# EAGLE design Patch_Anetnna_16_8 (EAGLE 7.4.0)
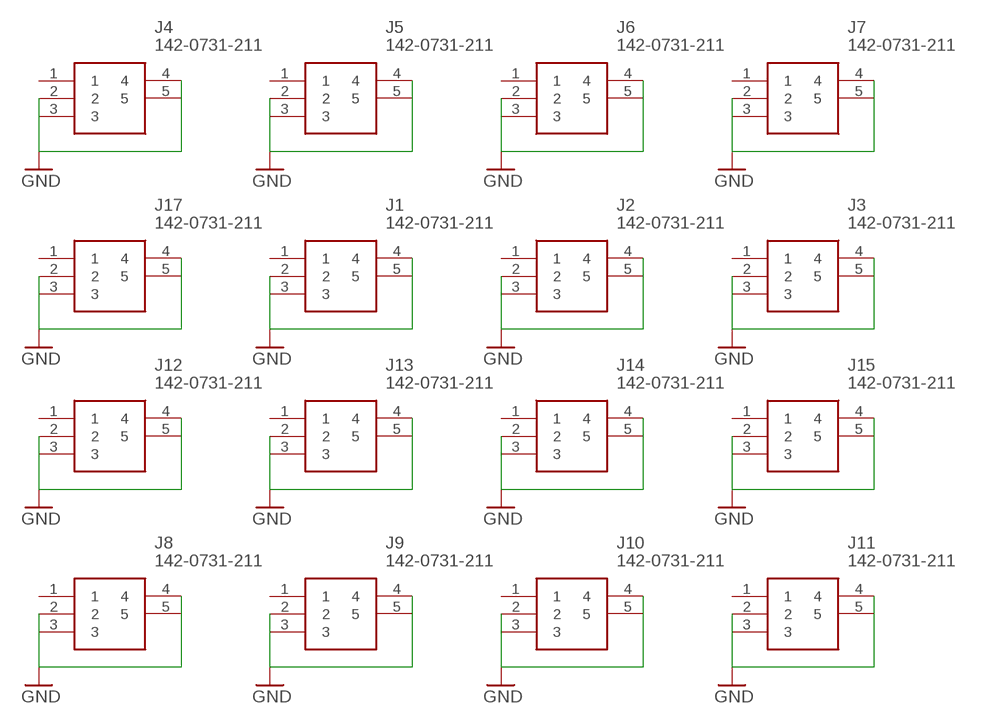
[diagram p0: schematic, sheet 1]

## Parts
J1  142-0731-211  [1420731211]
J2  142-0731-211  [1420731211]
J3  142-0731-211  [1420731211]
J4  142-0731-211  [1420731211]
J5  142-0731-211  [1420731211]
J6  142-0731-211  [1420731211]
J7  142-0731-211  [1420731211]
J8  142-0731-211  [1420731211]
J9  142-0731-211  [1420731211]
J10  142-0731-211  [1420731211]
J11  142-0731-211  [1420731211]
J12  142-0731-211  [1420731211]
J13  142-0731-211  [1420731211]
J14  142-0731-211  [1420731211]
J15  142-0731-211  [1420731211]
J17  142-0731-211  [1420731211]

## Nets
GND: J1.2 J1.3 J1.4 J1.5 J2.2 J2.3 J2.4 J2.5 J3.2 J3.3 J3.4 J3.5 J4.2 J4.3 J4.4 J4.5 J5.2 J5.3 J5.4 J5.5 J6.2 J6.3 J6.4 J6.5 J7.2 J7.3 J7.4 J7.5 J8.2 J8.3 J8.4 J8.5 J9.2 J9.3 J9.4 J9.5 J10.2 J10.3 J10.4 J10.5 J11.2 J11.3 J11.4 J11.5 J12.2 J12.3 J12.4 J12.5 J13.2 J13.3 J13.4 J13.5 J14.2 J14.3 J14.4 J14.5 J15.2 J15.3 J15.4 J15.5 J17.2 J17.3 J17.4 J17.5
Unconnected: J1.1 J2.1 J3.1 J4.1 J5.1 J6.1 J7.1 J8.1 J9.1 J10.1 J11.1 J12.1 J13.1 J14.1 J15.1 J17.1

## Library data of the parts
J1-J15 J17 = 142-0731-211:142-0731-211: SMA Connector Jack, Female Socket 50 Ohms Through Hole Solder Source: Datasheet <https://www.cinch.com/media/drawings/products/rf-microwave/connectors/dr-CCS-JOHNS-142-0731-211.pdf>; DESCRIPTION: SMA Connector Jack, Female Socket 50 Ohms Through Hole Solder; HEIGHT: 9.8852mm; MANUFACTURER_NAME: Cinch Connectivity Solutions; MANUFACTURER_PART_NUMBER: 142-0731-211; MOUSER_PART_NUMBER: 530-142-0731-211; MOUSER_PRICE-STOCK: https://www.mouser.co.uk/ProductDetail/Johnson-Cinch-Connectivity-Solutions/142-0731-211?qs=HFfMDpzxxd0OVzI3hm9tuA%3D%3D

## Board
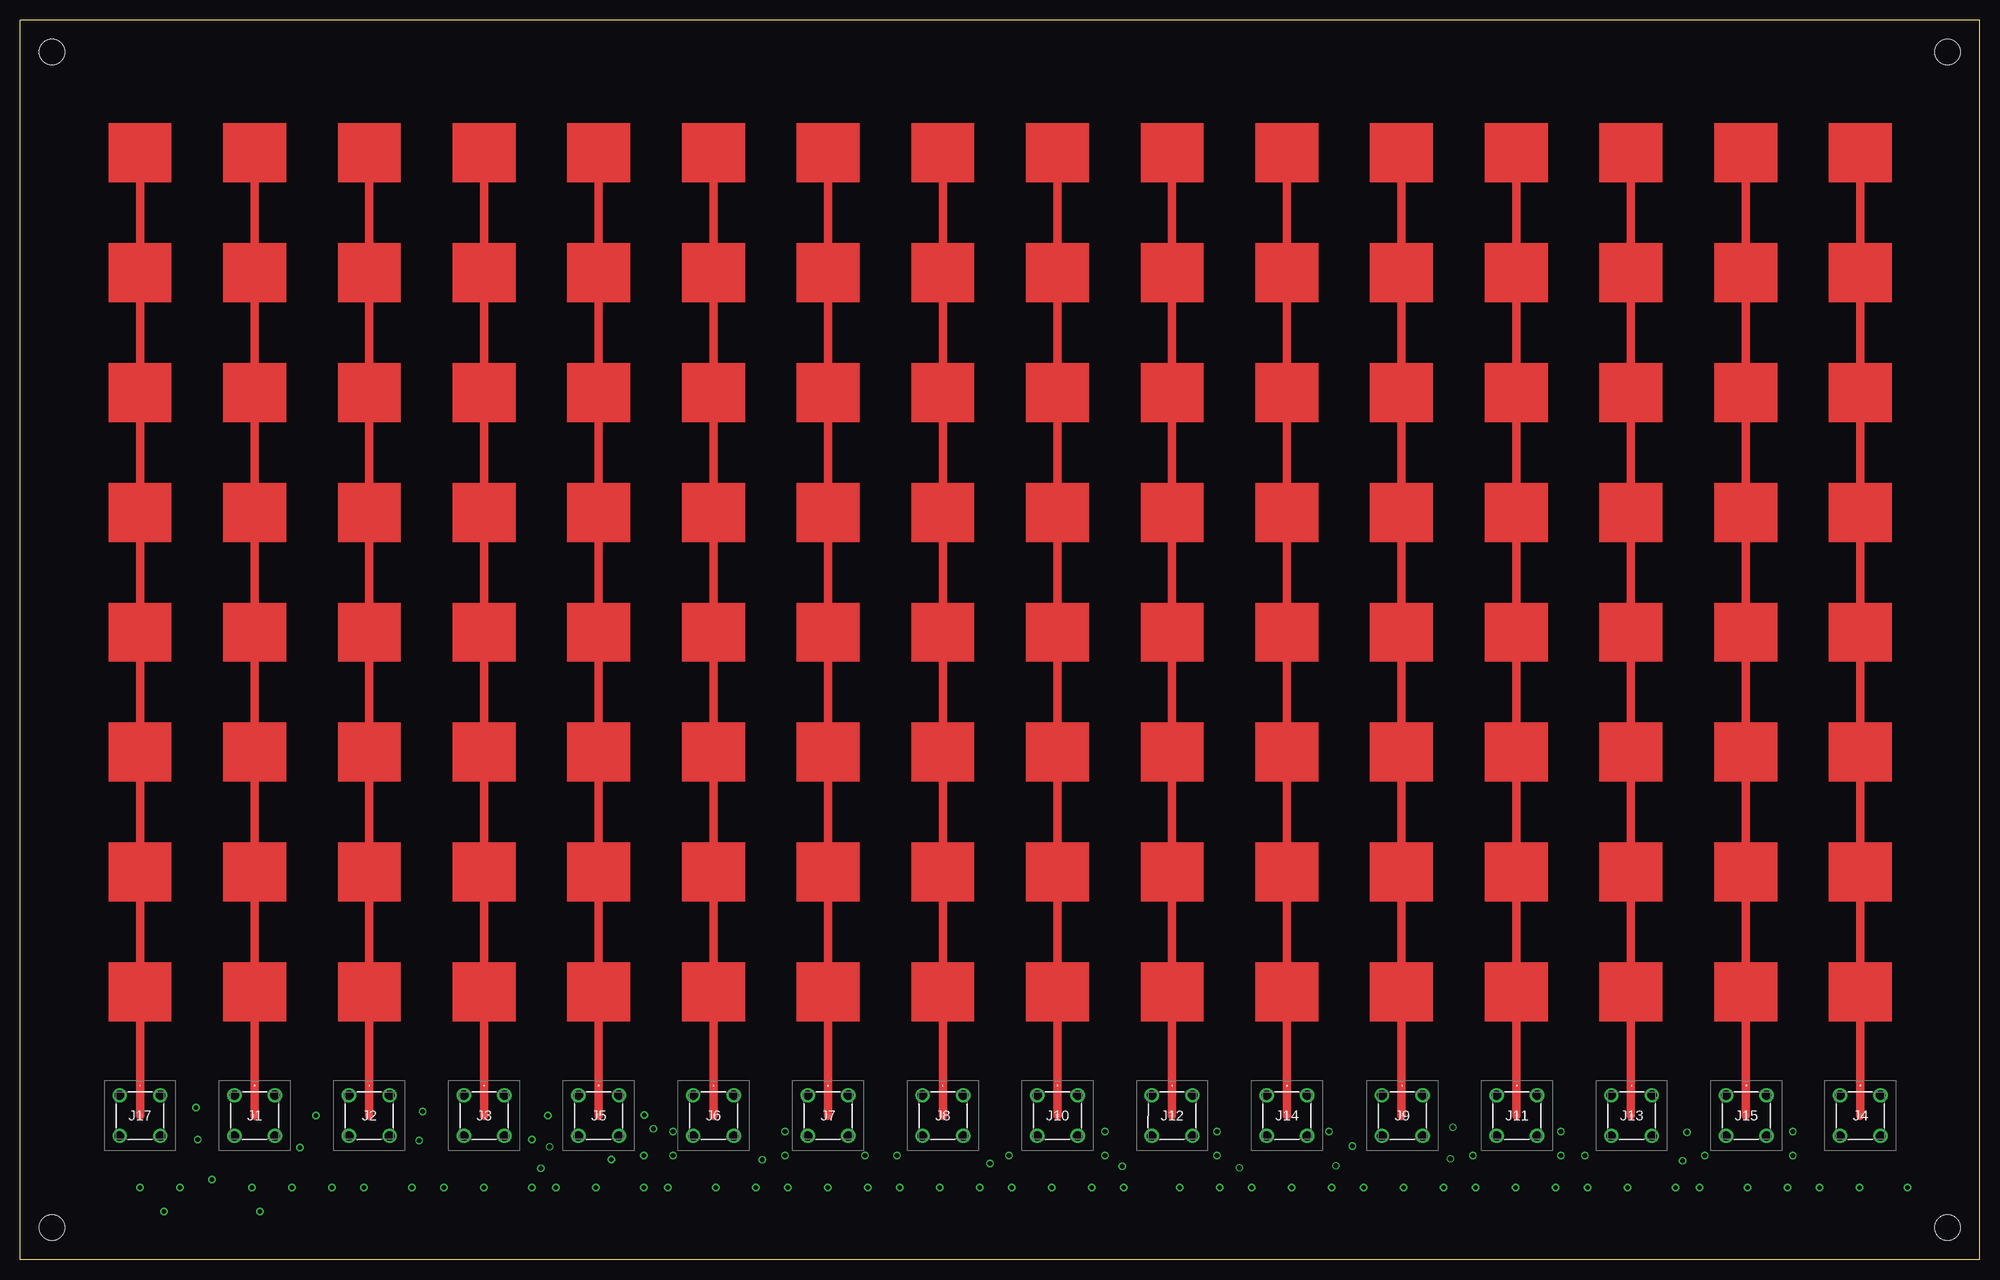
[diagram p1: board, top side]
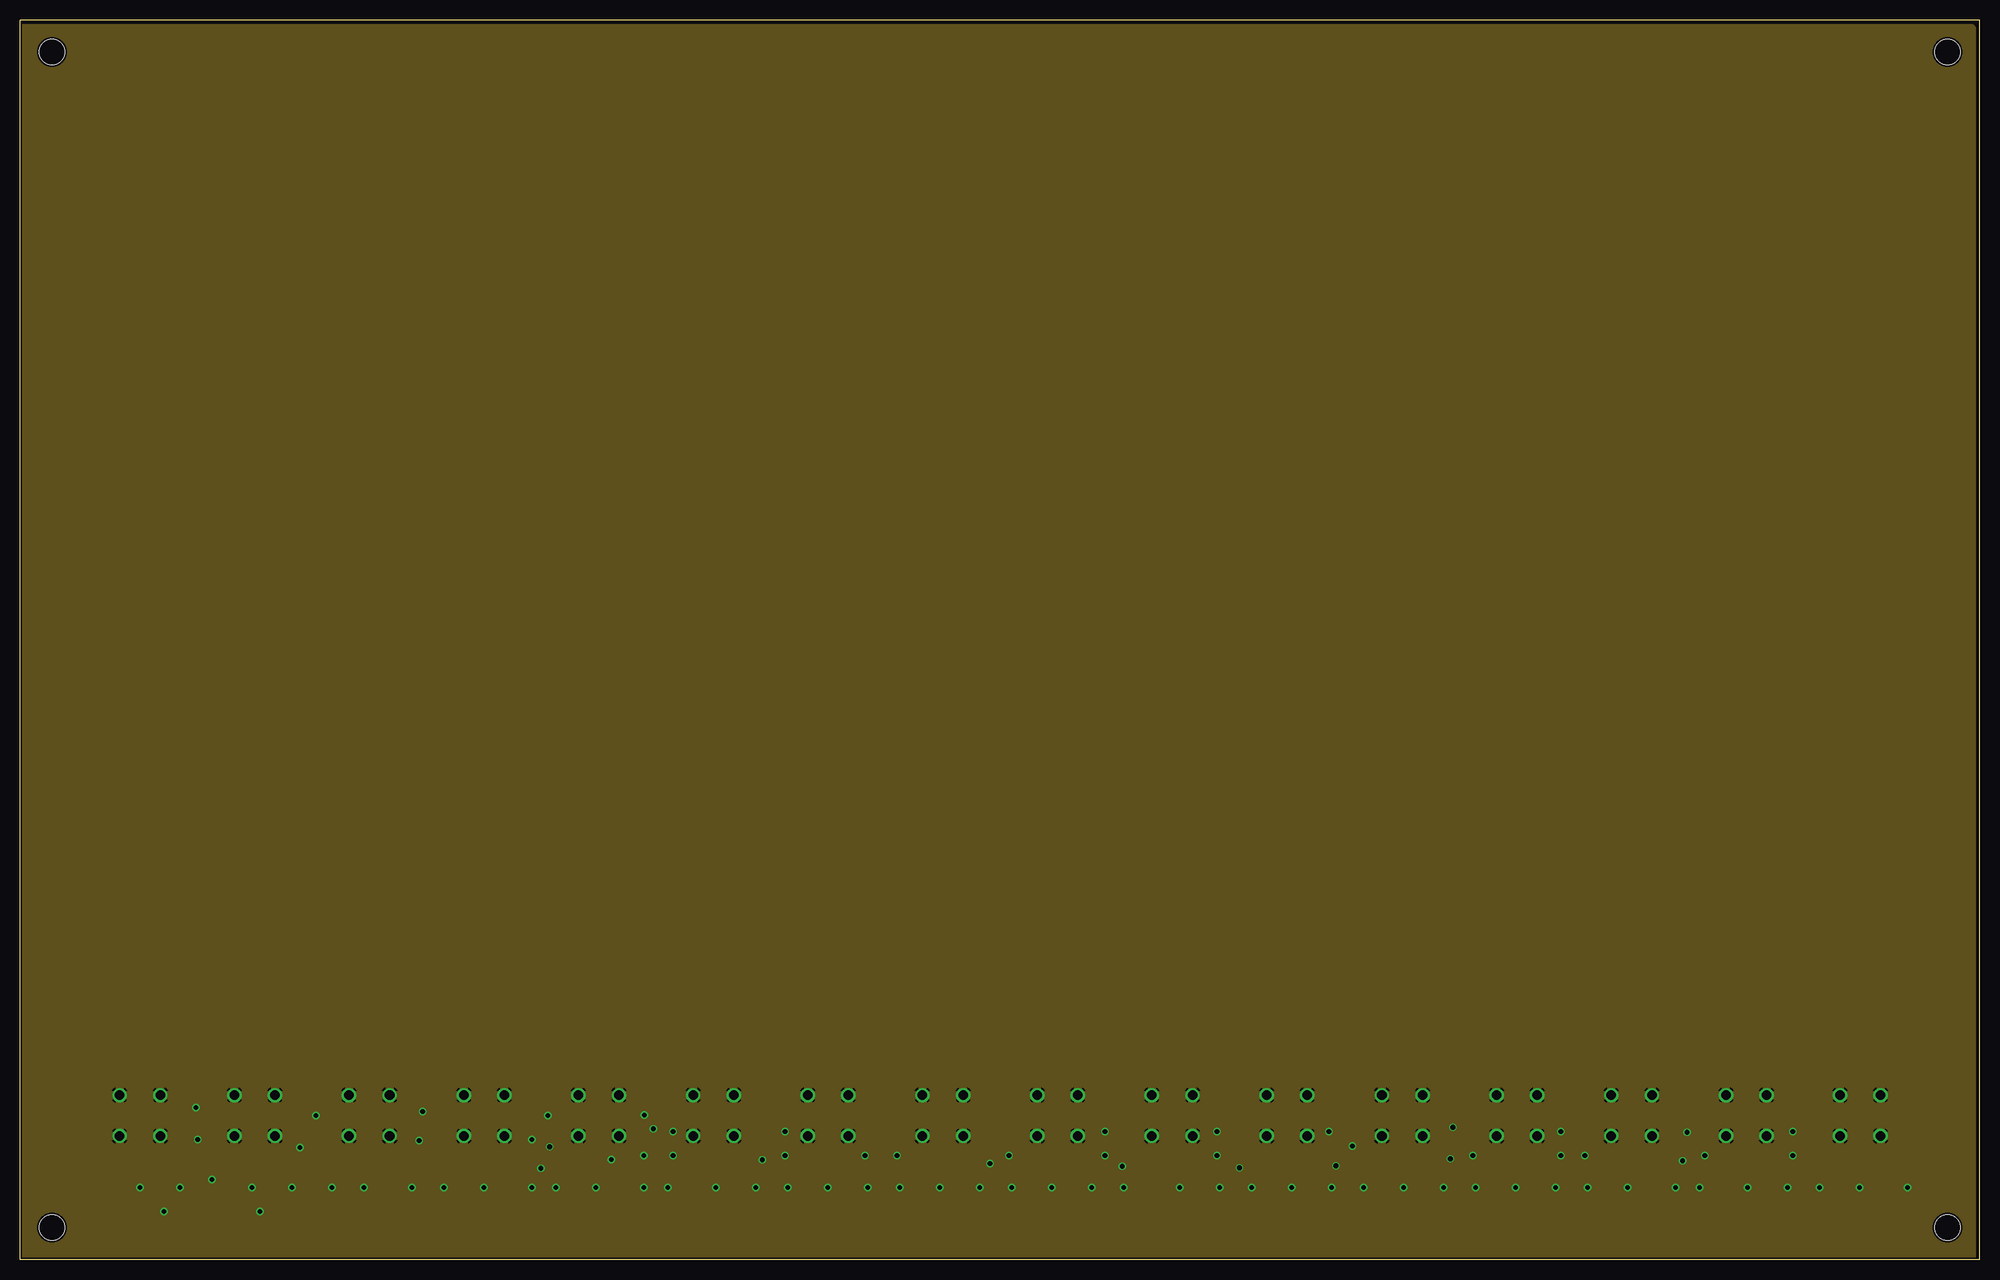
[diagram p2: board, inner layer Route2]

Size 245 x 155 mm. Coordinates in mm from the lower left corner, seen from the top.
Outline: 245,0 245,155 0,155 0,0 245,0
Copper layers (1+2*3+16): Top 0.035mm / dielectric 20mil / Route2 0.035mm / dielectric 0.102mm / Route3 0.035mm / dielectric 0.8mm / Bottom 0.035mm
Design rules "eC_4Layer_PClass4_BaseCopperO35-I70 *": minimum track width 0.2mm, minimum drill 0.35mm, track to track 0.25mm, track to pad 0.25mm, pad to pad 0.25mm, via to via 0.25mm, smd to smd 0mil, copper to edge 0.25mm, drill to drill 0.35mm, minimum pad ring 0.2mm, minimum via ring 0.15mm, stop-mask expansion 0mil, vias tented up to drill 0.45mm, thermal gap 0.2mm
Holes 3.2 mm at 4,4 241,4 241,151 4,151

### Footprints (pad centres in the part's own frame; a part is rotated, then mirrored left to right if it is on the bottom)
1420731211 = smd 0.559 x 0.559: 1 0,0 | drill 1.194 pad 1.791: 2 -2.54,2.54; 3 -2.54,-2.54; 4 2.54,-2.54; 5 2.54,2.54

### Placement (x,y rotation side)
J1  29.34,18 0 top
J2  43.68,18 0 top
J3  58.02,18 0 top
J4  230.1,18 0 top
J5  72.36,18 0 top
J6  86.7,18 0 top
J7  101.04,18 0 top
J8  115.38,18 0 top
J9  172.82,18 0 top
J10  129.72,18 0 top
J11  187.16,18 0 top
J12  144.06,18 0 top
J13  201.5,18 0 top
J14  158.4,18 0 top
J15  215.84,18 0 top
J17  15,18 0 top

### Tracks (layer width: path | path; a pad name or v marks a point on that pad's centre or on a via)
GND  (via drill 0.6)
  other vias: 15,9 20,9 18,6 22.21,15 24,10 22,19 29,9 34,9 30,6 35,14 39,9 43,9 43,9 49,9 37,18 49.89,14.88 50.33,18.5 53,9 53,9 58,9 64,9 66,18 64,15 66.21,14.09 67,9 72,9 78,9 78,13 79.18,16.35 65.13,11.4 81,9 78.07,18.07 81.66,16 73.94,12.5 81.66,13 92,9 96,9 87,9 201,9 207,9 192.66,13 192.66,16 192.66,16 195.66,13 210,9 216,9 221,9 225,9 207.87,12.35 210.66,13 208.43,15.89 230,9 236,9 221.66,13 221.66,16 95.66,16 92.82,12.45 95.66,13 106,9 110,9 101,9 105.66,13 109.66,13 120,9 124,9 115,9 121.28,12 123.66,13 134,9 138,9 129,9 135.66,16 135.66,13 137.82,11.66 150,9 154,9 145,9 149.66,16 149.66,13 152.45,11.46 164,9 168,9 159,9 163.66,16 164.53,11.73 166.59,14.19 178,9 182,9 173,9 179.15,16.55 178.85,12.61 181.66,13 192,9 196,9 187,9
  pour Route2: 0,154 0,0 244,0 244,154
N$17
  Top 1.08: 15,29.79 15,135.9
N$18
  Top 1.08: 15,18 15,29.7
N$19
  Top 1.08: 29.34,29.79 29.34,135.9
N$20
  Top 1.08: 29.34,18 29.34,29.7
N$21
  Top 1.08: 43.68,29.79 43.68,135.9
N$22
  Top 1.08: 43.68,18 43.68,29.7
N$23
  Top 1.08: 58.02,29.79 58.02,135.9
N$24
  Top 1.08: 58.02,18 58.02,29.7
N$25
  Top 1.08: 72.36,29.79 72.36,135.9
N$26
  Top 1.08: 72.36,18 72.36,29.7
N$27
  Top 1.08: 86.7,29.79 86.7,135.9
N$28
  Top 1.08: 86.7,18 86.7,29.7
N$29
  Top 1.08: 101.04,29.79 101.04,135.9
N$30
  Top 1.08: 101.04,18 101.04,29.7
N$31
  Top 1.08: 115.38,29.79 115.38,135.9
N$32
  Top 1.08: 115.38,18 115.38,29.7
N$33
  Top 1.08: 129.72,29.79 129.72,135.9
N$34
  Top 1.08: 129.72,18 129.72,29.7
N$35
  Top 1.08: 144.06,29.79 144.06,135.9
N$36
  Top 1.08: 144.06,18 144.06,29.7
N$37
  Top 1.08: 158.4,29.79 158.4,135.9
N$38
  Top 1.08: 158.4,18 158.4,29.7
N$39
  Top 1.08: 172.74,29.79 172.74,135.9
N$40
  Top 1.08: 172.74,18 172.74,29.7
N$41
  Top 1.08: 187.08,29.79 187.08,135.9
N$42
  Top 1.08: 187.08,18 187.08,29.7
N$43
  Top 1.08: 201.42,29.79 201.42,135.9
N$44
  Top 1.08: 201.42,18 201.42,29.7
N$45
  Top 1.08: 215.76,29.79 215.76,135.9
N$46
  Top 1.08: 215.76,18 215.76,29.7
N$47
  Top 1.08: 230.1,29.79 230.1,135.9
N$48
  Top 1.08: 230.1,18 230.1,29.7
(copper drawn outside any net)
  shapes: Top area x128

### Text on the board
tDocu: ANT_1_1 | ANT_2_1 | ANT_3_1 | ANT_4_1 | ANT_1_2 | ANT_2_2 | ANT_3_2 | ANT_4_2 | ANT_1_3 | ANT_2_3 | ANT_3_3 | ANT_4_3 | ANT_1_4 | ANT_2_4 | ANT_3_4 | ANT_4_4